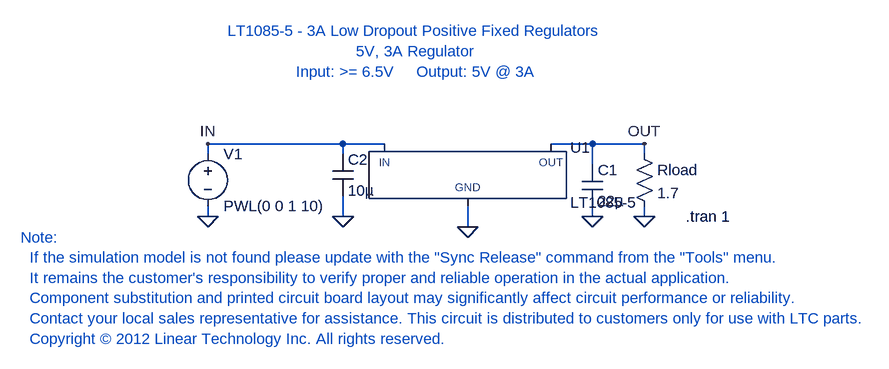
[diagram p0: schematic LT1085-5_TA01.asc]
LT1085-5_TA01.asc, the LTspice schematic file:
Version 4
SHEET 1 2800 1520
WIRE 1488 896 1280 896
WIRE 1552 896 1488 896
WIRE 1872 896 1808 896
WIRE 1952 896 1872 896
WIRE 1280 912 1280 896
WIRE 1488 912 1488 896
WIRE 1952 912 1952 896
WIRE 1872 928 1872 896
WIRE 1280 1008 1280 992
WIRE 1488 1008 1488 976
WIRE 1872 1008 1872 992
WIRE 1952 1008 1952 992
WIRE 1680 1024 1680 992
FLAG 1952 896 OUT
FLAG 1952 1008 0
FLAG 1280 1008 0
FLAG 1872 1008 0
FLAG 1280 896 IN
FLAG 1680 1024 0
FLAG 1488 1008 0
SYMBOL VOLTAGE 1280 896 R0
WINDOW 123 0 0 Left 2
SYMATTR InstName V1
SYMATTR Value PWL(0 0 1 10)
SYMATTR SpiceLine Rser=0.1
SYMBOL RES 1936 896 R0
SYMATTR InstName Rload
SYMATTR Value 1.7
SYMBOL cap 1856 928 R0
SYMATTR InstName C1
SYMATTR Value 22µ
SYMATTR SpiceLine Rser=10m
SYMBOL cap 1472 912 R0
SYMATTR InstName C2
SYMATTR Value 10µ
SYMBOL PowerProducts\\LT1085-5 1680 896 R0
SYMATTR InstName U1
TEXT 2016 1008 Left 2 !.tran 1
TEXT 1600 800 Bottom 2 ;LT1085-5 - 3A Low Dropout Positive Fixed Regulators\n5V, 3A Regulator\nInput: >= 6.5V     Output: 5V @ 3A
TEXT 992 1040 Left 2 ;Note:\n  If the simulation model is not found please update with the "Sync Release" command from the "Tools" menu.\n  It remains the customer's responsibility to verify proper and reliable operation in the actual application.\n  Component substitution and printed circuit board layout may significantly affect circuit performance or reliability.\n  Contact your local sales representative for assistance. This circuit is distributed to customers only for use with LTC parts.\n  Copyright © 2012 Linear Technology Inc. All rights reserved.

The netlist it stands for:
* LT1085-5_TA01.asc
V1 IN 0 PWL(0 0 1 10) Rser=0.1
Rload OUT 0 1.7
C1 OUT 0 22µ Rser=10m
C2 IN 0 10µ
XU1 0 OUT IN LT1085-5  ; pins GND OUT IN
.tran 1
* LT1085-5 - 3A Low Dropout Positive Fixed Regulators
* 5V, 3A Regulator
* Input: >= 6.5V     Output: 5V @ 3A
* Note:
*   If the simulation model is not found please update with the "Sync Release" command from the "Tools" menu.
*   It remains the customer's responsibility to verify proper and reliable operation in the actual application.
*   Component substitution and printed circuit board layout may significantly affect circuit performance or reliability.
*   Contact your local sales representative for assistance. This circuit is distributed to customers only for use with LTC parts.
*   Copyright © 2012 Linear Technology Inc. All rights reserved.
.backanno
.end